# EAGLE schematic Minimotor (EAGLE 9.6.2)
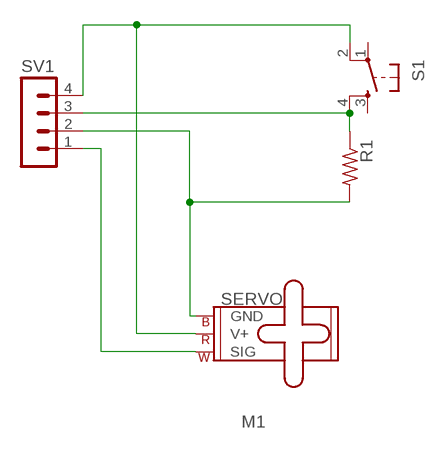
[diagram p0: schematic, sheet 1]

## Parts
M1  SERVO  [1X03]
R1  R-US_0204/7  [0204/7]
S1  TAC_SWITCHPTH  [TACTILE-PTH]
SV1  MA04-1  [MA04-1]

## Nets
N$1: R1.1 S1.4 SV1.3
N$2: M1.3(GND) R1.2 SV1.2
N$3: M1.1(SIG) SV1.1
N$4: M1.2(V+) S1.2 SV1.4
Unconnected: S1.1 S1.3

## Library data of the parts
M1 = SparkFun-Electromechanical:SERVO: Servo Motor 3-pin connector for a standard servo motor (voltage supply, ground, and control signal.) SparkFun Products Servo - Generic (Sub-Micro Size) <https://www.sparkfun.com/products/9065> (ROB-09065) Servo - Generic High Torque Continuous Rotation (Standard Size) <https://www.sparkfun.com/products/9347> (ROB-09347) Servo - Generic High Torque (Standard Size) <https://www.sparkfun.com/products/11965> (ROB-11965)
R1 = rcl:R-US_: RESISTOR, American symbol; SPICEPREFIX: R
S1 = SparkFun-Retired:TAC_SWITCH: Momentary Switch Button commonly used for reset or general input. Spark Fun Electronics SKU : COM-00097 SMT- SWCH-08247
SV1 = con-lstb:MA04-1: PIN HEADER; OC_FARNELL: unknown; OC_NEWARK: unknown